# Altium schematic sheet BusInput.SchDoc: StepMotor Controller
size A4; Organization: NTUST EE-305; Address1: No.43, Sec. 4, Keelung Rd.; Address2: Da’an Dist.; Address3: Taipei 106; Address4: Taiwan (R.O.C.); DocumentNumber: 5; Revision: 1.0; SheetNumber: 5; SheetTotal: 8
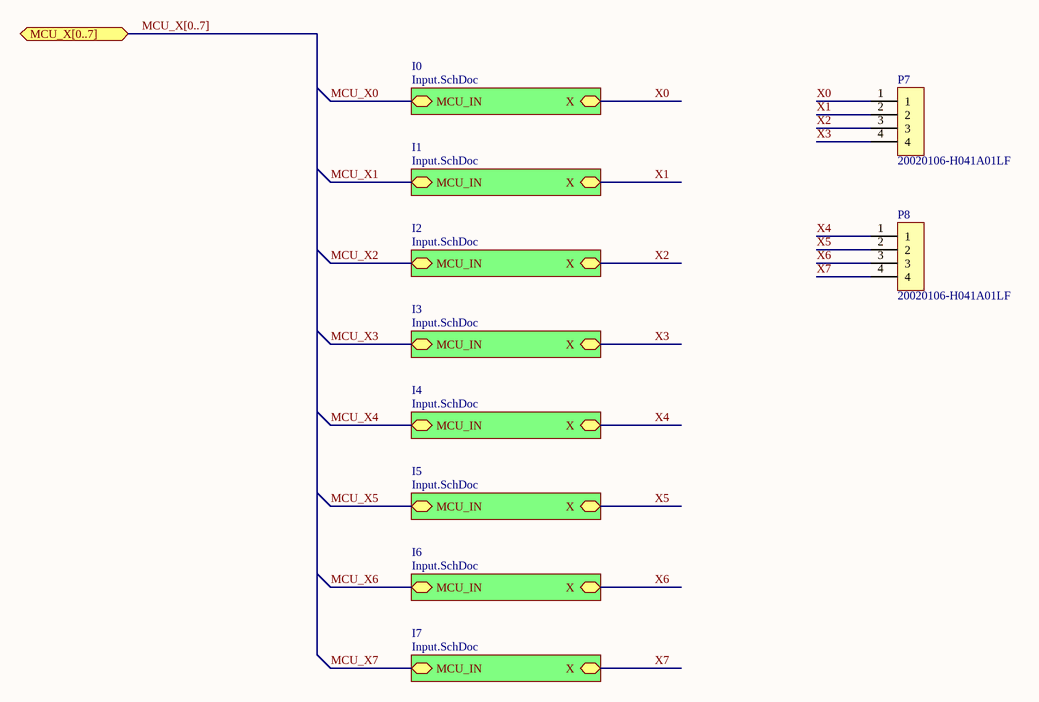
[diagram p0: BusInput.SchDoc]

## Parts
P7  20020106-H041A01LF  [20020106-H041A01LF]
P8  20020106-H041A01LF  [20020106-H041A01LF]

## Sub-sheets
I0 = Input.SchDoc: MCU_IN, X
I1 = Input.SchDoc: MCU_IN, X
I2 = Input.SchDoc: MCU_IN, X
I3 = Input.SchDoc: MCU_IN, X
I4 = Input.SchDoc: MCU_IN, X
I5 = Input.SchDoc: MCU_IN, X
I6 = Input.SchDoc: MCU_IN, X
I7 = Input.SchDoc: MCU_IN, X

## Ports
MCU_X[0..7]

## Nets
MCU_X0: sheet I0/MCU_IN
MCU_X1: sheet I1/MCU_IN
MCU_X2: sheet I2/MCU_IN
MCU_X3: sheet I3/MCU_IN
MCU_X4: sheet I4/MCU_IN
MCU_X5: sheet I5/MCU_IN
MCU_X6: sheet I6/MCU_IN
MCU_X7: sheet I7/MCU_IN
X0: P7.1 ; sheet I0/X
X1: P7.2 ; sheet I1/X
X2: P7.3 ; sheet I2/X
X3: P7.4 ; sheet I3/X
X4: P8.1 ; sheet I4/X
X5: P8.2 ; sheet I5/X
X6: P8.3 ; sheet I6/X
X7: P8.4 ; sheet I7/X

## Buses and harness runs
bus MCU_X[0..7] = port MCU_X[0..7]

## Notes on the sheet
- Title
- Name
- Size:
- Revision:
- A4
- Date:
- Time:
- Sheet
- of

## Library data of the parts
P7 P8 = Amphenol FCI: TERM BLOCK HDR 4POS VERT 5.08MM